# EAGLE design Temperature Control LAB ESP32 (EAGLE 9.6.2)
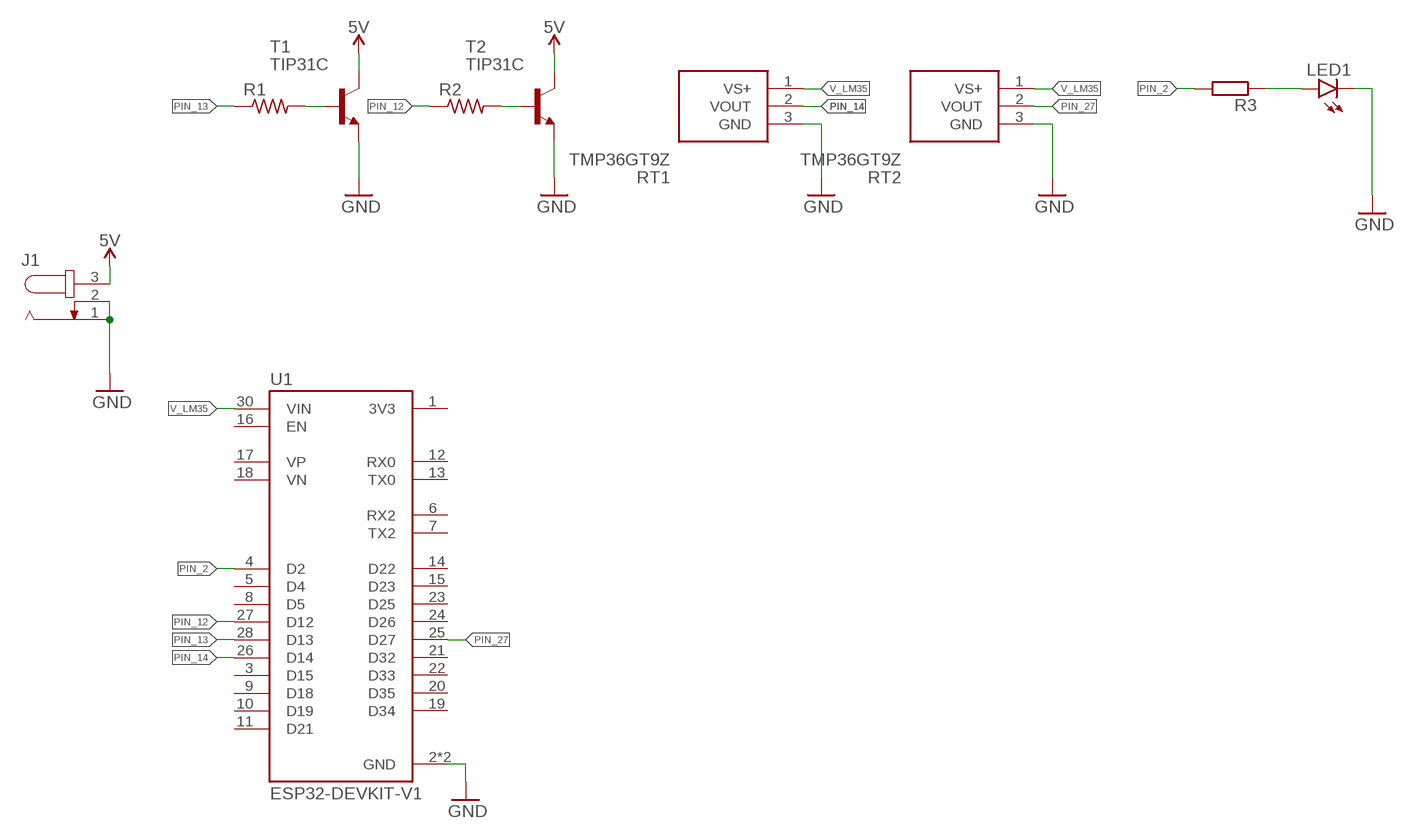
[diagram p0: schematic, sheet 1]

## Parts
J1  JACK-PLUG0  [SPC4077]
LED1  LED5MM  [LED5MM]
R1  R-US_M0805  [M0805]
R2  R-US_M0805  [M0805]
R3  R-EU_R0805  [R0805]
RT1  TMP36GT9Z  [TO-92]
RT2  TMP36GT9Z  [TO-92]
T1  TIP31C  [TO220]
T2  TIP31C  [TO220]
U1  ESP32-DEVKIT-V1  [MODULE_ESP32_DEVKIT_V1]

## Nets
5V: J1.3 T1.2(C) T2.2(C)
GND: J1.1 J1.2 LED1.K(C) RT1.3(GND) RT2.3(GND) T1.3(E) T2.3(E) U1.2(GND) U1.29(GND)
N$1: R1.2 T1.1(B)
N$2: R2.2 T2.1(B)
N$3: LED1.A R3.1
PIN_2: R3.2 U1.4(D2)
PIN_12: R2.1 U1.27(D12)
PIN_13: R1.1 U1.28(D13)
PIN_14: RT1.2(VOUT) U1.26(D14)
PIN_27: RT2.2(VOUT) U1.25(D27)
V_LM35: RT1.1(VS+) RT2.1(VS+) U1.30(VIN)
Unconnected: U1.1(3V3) U1.3(D15) U1.5(D4) U1.6(RX2) U1.7(TX2) U1.8(D5) U1.9(D18) U1.10(D19) U1.11(D21) U1.12(RX0) U1.13(TX0) U1.14(D22) U1.15(D23) U1.16(EN) U1.17(VP) U1.18(VN) U1.19(D34) U1.20(D35) U1.21(D32) U1.22(D33) U1.23(D25) U1.24(D26)

## Library data of the parts
J1 = con-jack:JACK-PLUG: DC POWER JACK Power Jack, DC, Right Angle, Through Hole, Rated 5A at 16VDC, PC Terminals Distributor: Farnell (www.Farnell.de) Drawing: 84N1161.pdf / 84N1162.pdf Manufacturer: SPC Technology (www.spctechnology.com) Type: SPC4077 / SPC 4078; OC_FARNELL: unknown; OC_NEWARK: unknown
LED1 = led:LED: LED OSRAM: - CHIPLED LG R971, LG N971, LY N971, LG Q971, LY Q971, LO R971, LY R971 LH N974, LH R974 LS Q976, LO Q976, LY Q976 LO Q996 - Hyper CHIPLED LW Q18S LB Q993, LB Q99A, LB R99A - SideLED LS A670, LO A670, LY A670, LG A670, LP A670 LB A673, LV A673, LT A673, LW A673 LH A674 LY A675 LS A676, LA A676, LO A676, LY A676, LW A676 LS A679, LY A679, LG A679 - Hyper Micro SIDELED® LS Y876, LA Y876, LO Y876, LY Y876 LT Y87S - SmartLED LW L88C, LW L88S LB L89C, LB L89S, LG L890 LS L89K, LO L89K, LY L89K LS L896, LA L896, LO L896, LY L896 - TOPLED LS T670, LO T670, LY T670, LG T670, LP T670 LSG T670, LSP T670, LSY T670, LOP T670, LYG T670 LG T671, LOG T671, LSG T671 LB T673, LV T673, LT T673, LW T673 LH T674 LS T676, LA T676, LO T676, LY T676, LB T676, LH T676, LSB T676, LW T676 LB T67C, LV T67C, LT T67C, LS T67K, LO T67K, LY T67K, LW E67C LS E67B, LA E67B, LO E67B, LY E67B, LB E67C, LV E67C, LT E67C LW T67C LS T679, LY T679, LG T679 LS T770, LO T770, LY T770, LG T770, LP T770 LB T773, LV T773, LT T773, LW T773 LH T774 LS E675, LA E675, LY E675, LS T675 LS T776, LA T776, LO T776, LY T776, LB T776 LHGB T686 LT T68C, LB T68C - Hyper Mini TOPLED® LB M676 - Mini TOPLED Santana® LG M470 LS M47K, LO M47K, LY M47K Source: http://www.osram.convergy.de LUXEON: - LUMILED® LXK2-PW12-R00, LXK2-PW12-S00, LXK2-PW14-U00, LXK2-PW14-V00 LXK2-PM12-R00, LXK2-PM12-S00, LXK2-PM14-U00 LXK2-PE12-Q00, LXK2-PE12-R00, LXK2-PE12-S00, LXK2-PE14-T00, LXK2-PE14-U00 LXK2-PB12-K00, LXK2-PB12-L00, LXK2-PB12-M00, LXK2-PB14-N00, LXK2-PB14-P00, LXK2-PB14-Q00 LXK2-PR12-L00, LXK2-PR12-M00, LXK2-PR14-Q00, LXK2-PR14-R00 LXK2-PD12-Q00, LXK2-PD12-R00, LXK2-PD12-S00 LXK2-PH12-R00, LXK2-PH12-S00 LXK2-PL12-P00, LXK2-PL12-Q00, LXK2-PL12-R00 Source: www.luxeon.com KINGBRIGHT: KA-3528ASYC Source: www.kingbright.com
R1 R2 = rcl:R-US_: RESISTOR, American symbol; SPICEPREFIX: R
R3 = rcl:R-EU_: RESISTOR, European symbol; SPICEPREFIX: R
RT1 RT2 = TMP36GT9Z:TMP36GT9Z: TMP36GT9Z, Temperature Sensor +/-3C Serial-2 Wire 2.7 5.5 V 3-Pin TO-92 Source: Datasheet <https://datasheet.datasheetarchive.com/originals/distributors/SFDatasheet-4/sf-00085637.pdf>; DESCRIPTION: TMP36GT9Z, Temperature Sensor +/-3C Serial-2 Wire 2.7 5.5 V 3-Pin TO-92; HEIGHT: mm; MANUFACTURER_NAME: Analog Devices; MANUFACTURER_PART_NUMBER: TMP36GT9Z; MOUSER_PART_NUMBER: 584-TMP36GT9Z; MOUSER_PRICE-STOCK: https://www.mouser.co.uk/ProductDetail/Analog-Devices/TMP36GT9Z?qs=WIvQP4zGanhT97N47MSoHw%3D%3D
T1 T2 = TIP31C:TIP31C: NPN TRANSISTOR Check availability <https://pricing.snapeda.com/parts/TIP31C/STMicroelectronics/view-part?ref=eda>; AVAILABILITY: In Stock; CHECK_PRICES: https://www.snapeda.com/parts/TIP31C/STMicroelectronics/view-part/?ref=eda; DESCRIPTION: Bipolar (BJT) Transistor NPN 100 V 3 A - 2 W Through Hole TO-220; MF: STMicroelectronics; MP: TIP31C; PACKAGE: Package; PRICE: None; PURCHASE-URL: https://www.snapeda.com/api/url_track_click_mouser/?unipart_id=4792338&manufacturer=STMicroelectronics&part_name=TIP31C&search_term=None; SNAPEDA_LINK: https://www.snapeda.com/parts/TIP31C/STMicroelectronics/view-part/?ref=snap
U1 = ESP32-DEVKIT-V1:ESP32-DEVKIT-V1: Dual core, Wi-Fi: 2.4 GHz up to 150 Mbits/s,BLE (Bluetooth Low Energy) and legacy Bluetooth, 32 bits, Up to 240 MHz Check availability <https://pricing.snapeda.com/parts/ESP32-DEVKIT-V1/Do%20it/view-part?ref=eda>; AVAILABILITY: Not in stock; CHECK_PRICES: https://www.snapeda.com/parts/ESP32-DEVKIT-V1/Do+it/view-part/?ref=eda; DESCRIPTION: Dual core, Wi-Fi: 2.4 GHz up to 150 Mbits/s,BLE (Bluetooth Low Energy) and legacy Bluetooth, 32 bits, Up to 240 MHz; MF: Do it; MP: ESP32-DEVKIT-V1; PACKAGE: None; PRICE: None; SNAPEDA_LINK: https://www.snapeda.com/parts/ESP32-DEVKIT-V1/Do+it/view-part/?ref=snap

## Board
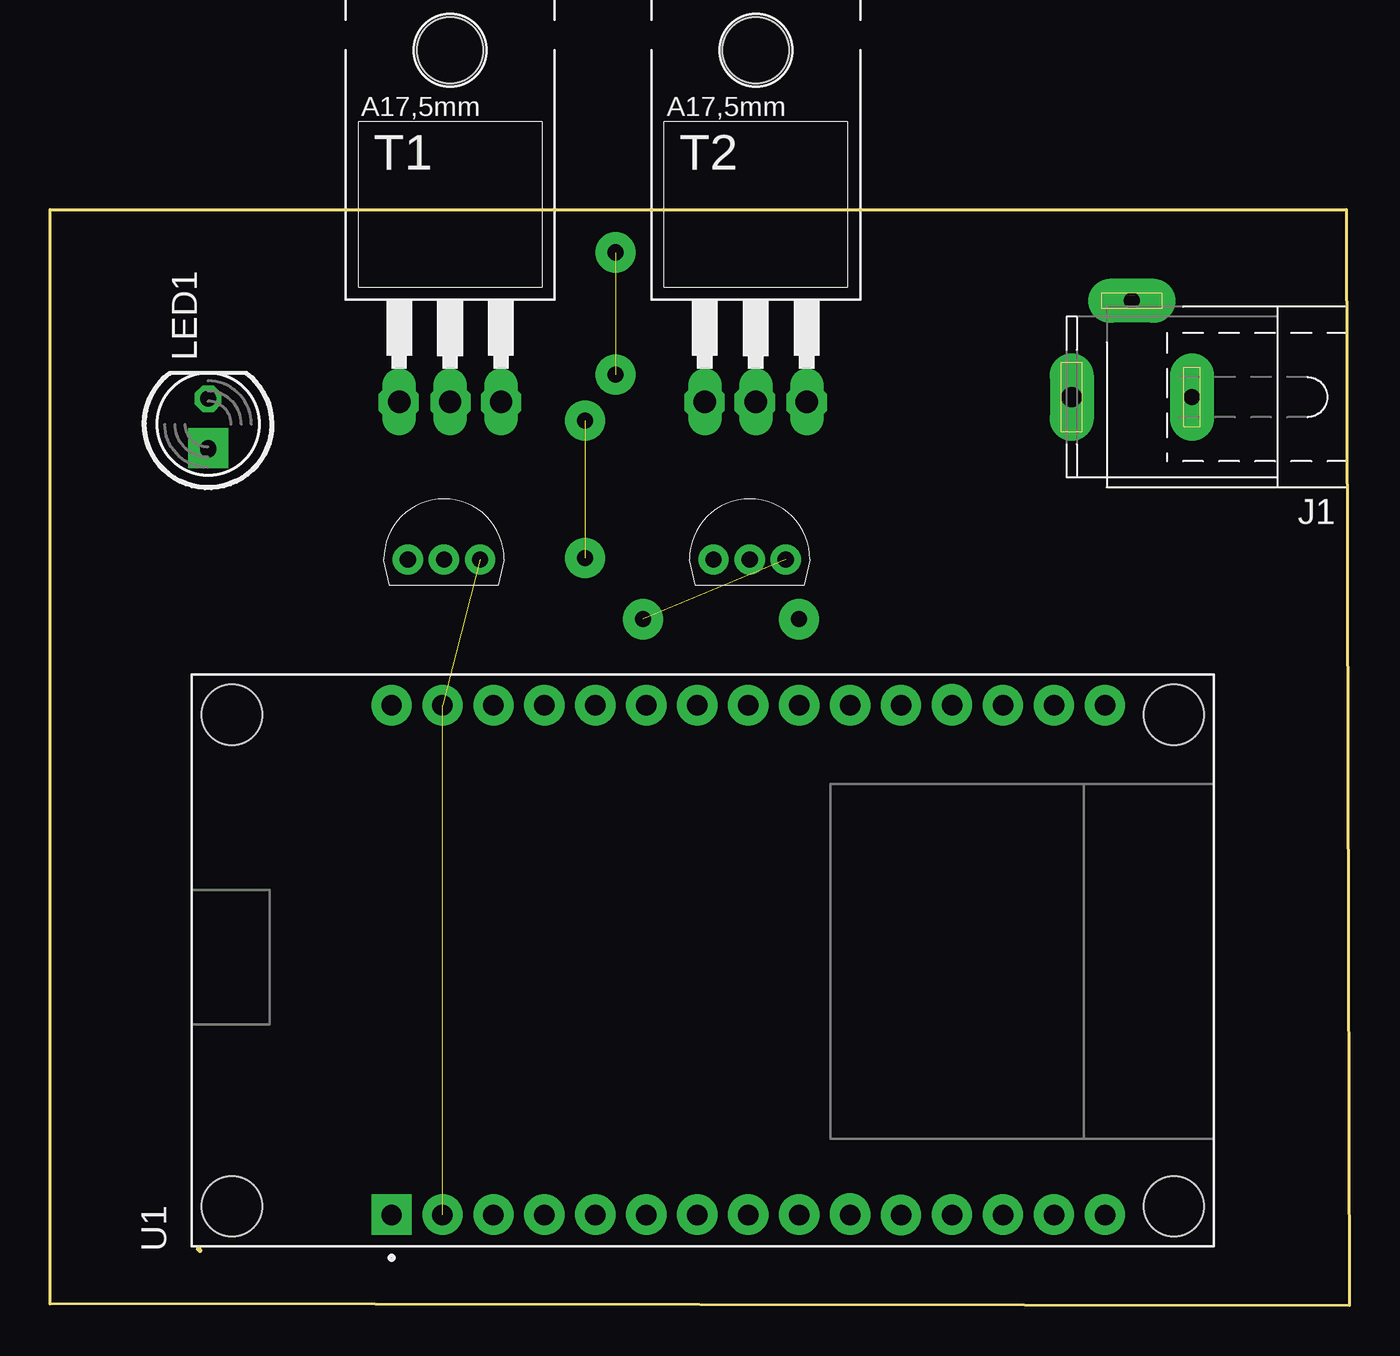
[diagram p1: board, top side]
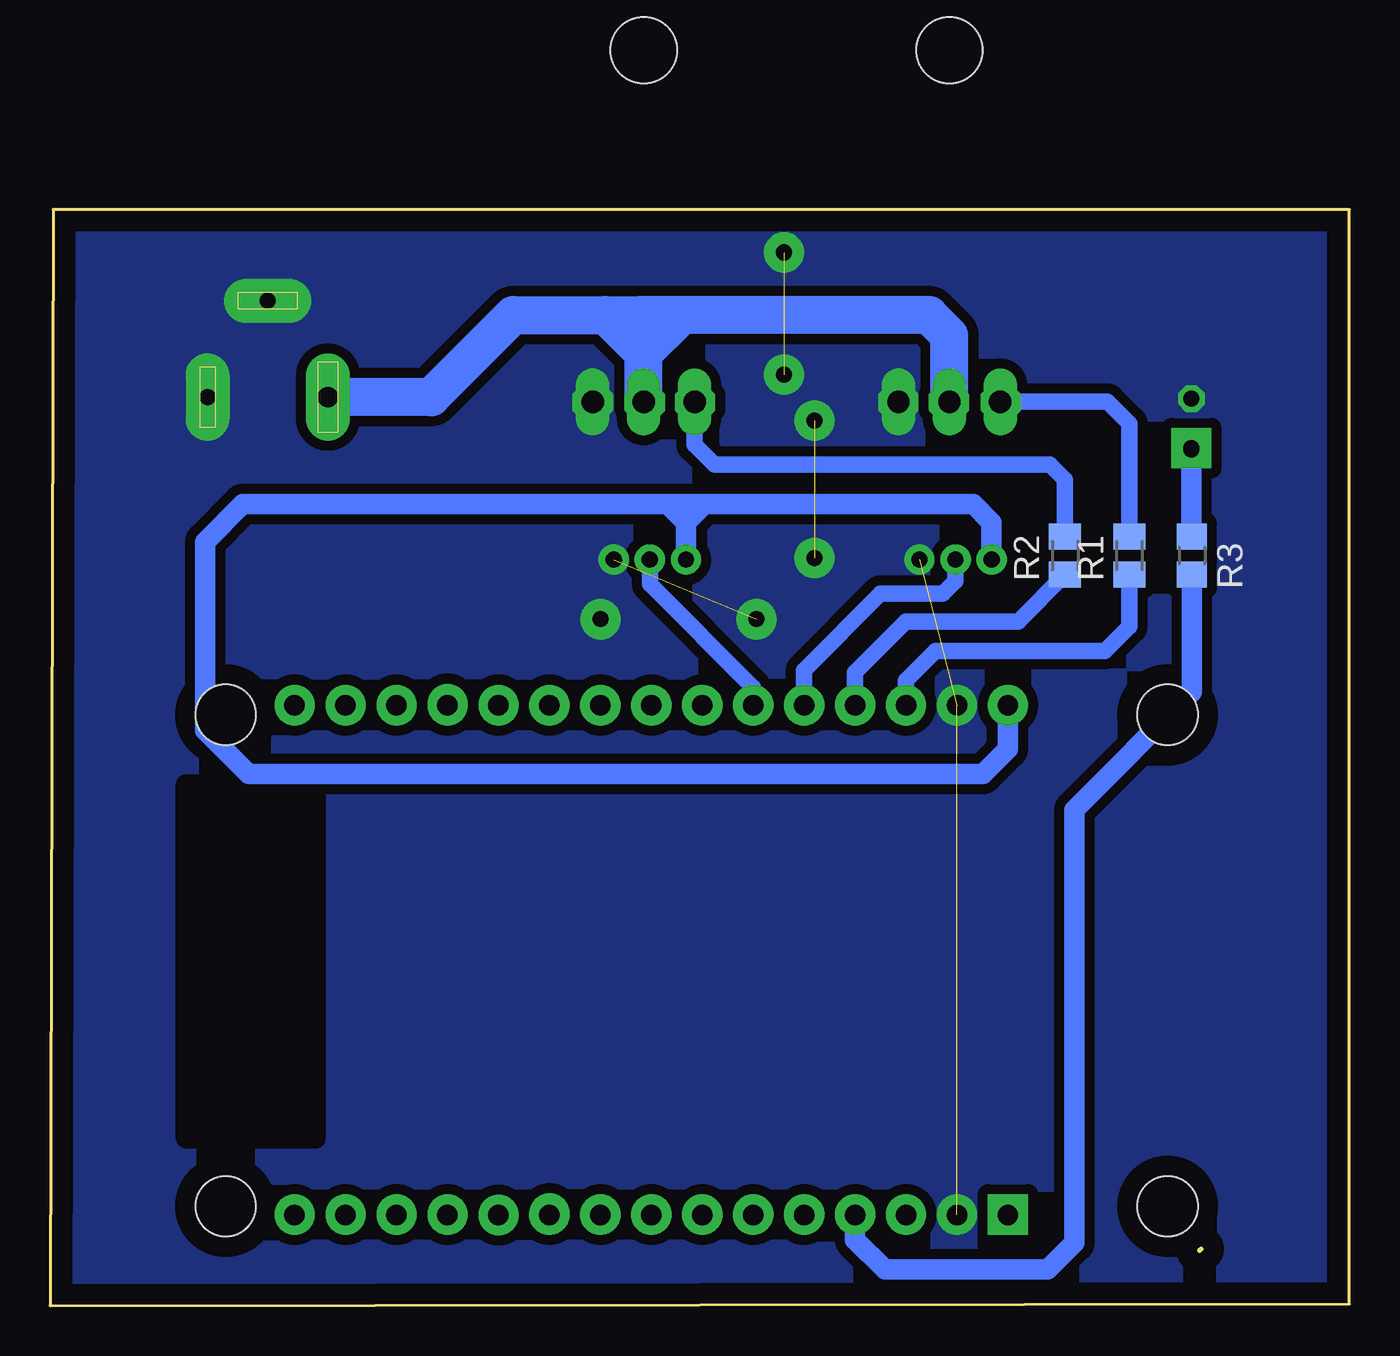
[diagram p2: board, bottom side, seen from below]

Size 64.77 x 54.64 mm. Coordinates in mm from the lower left corner, seen from the top.
Outline: 7.47,2.74 7.39,2.82
Outline: 0,0.08 0,54.64 64.62,54.64 64.77,0 0,0.08
Copper layers (1*16): Top 0.035mm / dielectric 1.5mm / Bottom 0.035mm
Design rules "default *": minimum track width 6mil, minimum drill 0.35mm, track to track 0.5mm, track to pad 0.5mm, pad to pad 0.5mm, via to via 0.5mm, smd to smd 6mil, copper to edge 40mil, drill to drill 6mil, minimum pad ring 10mil, minimum via ring 8mil, stop-mask expansion 4mil, vias tented up to drill 0mil, thermal gap 10mil

### Footprints (pad centres in the part's own frame; a part is rotated, then mirrored left to right if it is on the bottom)
SPC4077 = drill 0.8 pad 2.184 long: 1 -3,0; 2 0,-4.8 | drill 1 pad 2.184 long: 3 3,0
LED5MM = drill 0.813 octagon: A -1.27,0; K 1.27,0
M0805 = smd 1.3 x 1.6: 1 -0.95,0; 2 0.95,0
R0805 = smd 1.3 x 1.5: 1 -0.95,0; 2 0.95,0
TO-92 = drill 0.81 pad 1.51: 1 0,-1.8; 2 0,0; 3 0,1.8
TO220 = drill 1.118 long: 1 -2.54,-6.35; 2 0,-6.35; 3 2.54,-6.35 | hole 3.302: 0,11.176
MODULE_ESP32_DEVKIT_V1 = drill 1.02 pad 2 square: 1 -12.7,15.515 | drill 1.02 pad 2: 2 -12.7,12.975; 3 -12.7,10.435; 4 -12.7,7.895; 5 -12.7,5.355; 6 -12.7,2.815; 7 -12.7,0.275; 8 -12.7,-2.265; 9 -12.7,-4.805; 10 -12.7,-7.345; 11 -12.7,-9.885; 12 -12.7,-12.425; 13 -12.7,-14.965; 14 -12.7,-17.505; 15 -12.7,-20.045; 16 12.7,-20.045; 17 12.7,-17.505; 18 12.7,-14.965; 19 12.7,-12.425; 20 12.7,-9.885; 21 12.7,-7.345; 22 12.7,-4.805; 23 12.7,-2.265; 24 12.7,0.275; 25 12.7,2.815; 26 12.7,5.355; 27 12.7,7.895; 28 12.7,10.435; 29 12.7,12.975; 30 12.7,15.515 | hole 3: -12.28,-23.475; 12.23,-23.475; 12.23,23.475; -12.28,23.475

### Placement (x,y rotation side)
J1  53.92,45.29 180 top
LED1  7.87,43.94 90 top
R1  10.97,37.39 90 bottom
R2  14.17,37.39 90 bottom
R3  7.85,37.39 270 bottom
RT1  19.63,37.19 270 top
RT2  34.87,37.19 270 top
T1  19.94,51.41 0 top
T2  35.18,51.41 0 top
U1  32.54,17.22 90 top

### Tracks (layer width: path | path; a pad name or v marks a point on that pad's centre or on a via)
5V
  Bottom 1.905: 37.08,49.38 41.68,49.38 45.77,45.29 J1.3 | 37.08,49.38 35.36,49.38 | T1.2 19.94,48.36 20.95,49.38 33.3,49.38 | 33.3,49.38 35.36,49.38 | T2.2 35.18,47.47 | 35.18,47.47 35.18,49.2 35.36,49.38 | 35.18,47.47 37.08,49.38 | 35.18,47.47 33.3,49.35 33.3,49.38
GND  (via drill 0.8 pad 2)  (5 unrouted)
  other vias: 22.48,45.03 37.72,45.03 29.57,34.21 37.34,34.21 26.67,37.26 26.67,44.12 28.19,46.41 28.19,52.5 19.56,29.95 19.56,4.55
  pour Bottom (isolate 0.5, no thermals): 0,54.64 64.77,54.64 64.77,0 0,0
N$1
  Bottom 0.813: R1.2 10.97,43.97 12.06,45.06 T1.1
  Bottom 1.016: T1.1
N$2
  Bottom 0.813: R2.2 14.17,41.17 14.94,41.94 31.65,41.94 32.64,42.93 T2.1
  Bottom 1.016: T2.1
N$3
  Bottom 1.016: R3.1 7.87,39.18 LED1.A
N$4  (via drill 0.8 pad 2)
  other vias: 17.02,29.95
N$5  (via drill 0.8 pad 2)
  other vias: 19.96,45.03
N$6  (via drill 0.8 pad 2)
  other vias: 17.37,45.03
N$7  (via drill 0.8 pad 2)
  other vias: 35.13,45.03
N$8  (via drill 0.8 pad 2)
  other vias: 32.61,45.03
N$10  (via drill 0.8 pad 2)
  other vias: 22.1,29.95
N$11  (via drill 0.8 pad 2)
  other vias: 24.64,29.95
N$12  (via drill 0.8 pad 2)
  other vias: 27.18,29.95
N$13  (via drill 0.8 pad 2)
  other vias: 29.72,29.95
N$14  (via drill 0.8 pad 2)
  other vias: 32.26,29.95
N$15  (via drill 0.8 pad 2)
  other vias: 34.8,29.95
N$16  (via drill 0.8 pad 2)
  other vias: 37.34,29.95
N$17  (via drill 0.8 pad 2)
  other vias: 39.88,29.95
N$18  (via drill 0.8 pad 2)
  other vias: 42.42,29.95
N$19  (via drill 0.8 pad 2)
  other vias: 44.96,30
N$20  (via drill 0.8 pad 2)
  other vias: 47.5,29.95
N$21  (via drill 0.8 pad 2)
  other vias: 50.04,29.95
N$22  (via drill 0.8 pad 2)
  other vias: 52.58,29.95
N$23  (via drill 0.8 pad 2)
  other vias: 17.02,4.55
N$25  (via drill 0.8 pad 2)
  other vias: 22.1,4.55
N$26  (via drill 0.8 pad 2)
  other vias: 24.64,4.55
N$27  (via drill 0.8 pad 2)
  other vias: 27.18,4.55
N$28  (via drill 0.8 pad 2)
  other vias: 29.72,4.55
N$29  (via drill 0.8 pad 2)
  other vias: 32.26,4.55
N$30  (via drill 0.8 pad 2)
  other vias: 34.8,4.55
N$31  (via drill 0.8 pad 2)
  other vias: 37.34,4.55
N$32  (via drill 0.8 pad 2)
  other vias: 39.88,4.6
N$33  (via drill 0.8 pad 2)
  other vias: 42.42,4.5
N$34  (via drill 0.8 pad 2)
  other vias: 44.96,4.55
N$35  (via drill 0.8 pad 2)
  other vias: 47.5,4.55
N$36  (via drill 0.8 pad 2)
  other vias: 50.04,4.55
N$37  (via drill 0.8 pad 2)
  other vias: 52.58,4.55
N$38  (via drill 0.8 pad 2)
  other vias: 7.87,42.75
PIN_2
  Bottom 1.016: R3.2 7.85,30.58 13.72,24.71 13.72,3.12 15.04,1.8 23.16,1.8 24.64,3.28 U1.4
PIN_12
  Bottom 0.813: R2.1 16.5,34.11 22.1,34.11 24.64,31.57 U1.27
PIN_13
  Bottom 0.813: U1.28 22.1,31.16 20.62,32.64 12.19,32.64 10.97,33.86 R1.1
PIN_14
  Bottom 0.813: RT1.2 19.63,36.12 20.27,35.48 23.37,35.48 27.18,31.67 U1.26
PIN_27
  Bottom 0.813: RT2.2 34.87,35.97 29.72,30.81 U1.25
V_LM35
  Bottom 1.016: U1.30 17.02,27.76 18.27,26.51 54.88,26.51 57.05,28.68 57.05,38.07 55.17,39.95 33.99,39.95 | RT1.1 17.83,39.04 18.75,39.95 32.36,39.95 | 33.99,39.95 33.12,39.95 | 33.12,39.95 32.36,39.95 | RT2.1 33.07,39.04 | 33.07,39.04 33.07,39.91 33.12,39.95 | 33.99,39.95 33.07,39.04 | 33.07,39.04 32.36,39.75 32.36,39.95